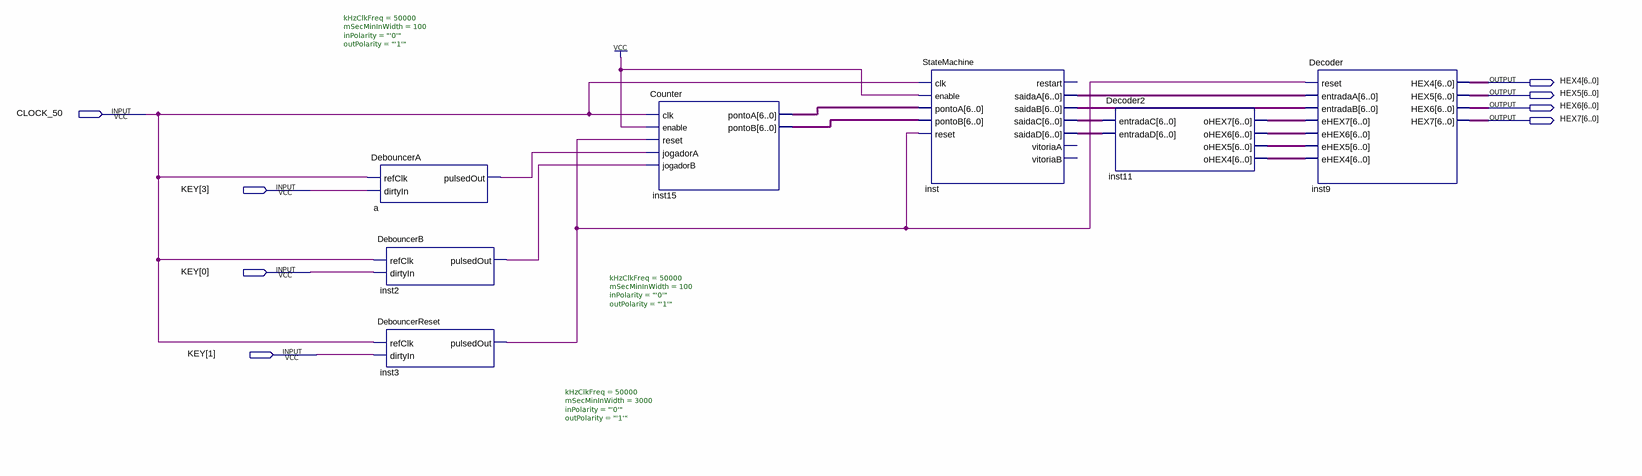
[diagram p0: schematic sheet]
// Quartus schematic bdfteste.bdf as structural Verilog: 7 symbols, 8 pins
module bdfteste (
  input  CLOCK_50,
  input  [3:0] KEY,
  output [6:0] HEX4,
  output [6:0] HEX5,
  output [6:0] HEX6,
  output [6:0] HEX7
);

  wire a_pulsedout, inst2_pulsedout, inst3_pulsedout;
  wire [6:0] inst11_ohex4, inst11_ohex5, inst11_ohex6, inst11_ohex7, inst15_pontoa, inst15_pontob,
       inst_saidaa, inst_saidab, inst_saidac, inst_saidad;

  DebouncerA #(.kHzClkFreq(50000), .mSecMinInWidth(100), .inPolarity("'0'"), .outPolarity("'1'")) a (
    .refClk(CLOCK_50), .dirtyIn(KEY[3]), .pulsedOut(a_pulsedout));
  DebouncerB #(.kHzClkFreq(50000), .mSecMinInWidth(100), .inPolarity("'0'"), .outPolarity("'1'")) inst2 (
    .refClk(CLOCK_50), .dirtyIn(KEY[0]), .pulsedOut(inst2_pulsedout));
  DebouncerReset #(.kHzClkFreq(50000), .mSecMinInWidth(3000), .inPolarity("'0'"), .outPolarity("'1'")) inst3 (
    .refClk(CLOCK_50), .dirtyIn(KEY[1]), .pulsedOut(inst3_pulsedout));
  Counter inst15 (
    .clk(CLOCK_50), .enable(1'b1), .reset(inst3_pulsedout), .jogadorA(a_pulsedout),
    .jogadorB(inst2_pulsedout), .pontoA(inst15_pontoa), .pontoB(inst15_pontob));
  StateMachine inst (
    .clk(CLOCK_50), .enable(1'b1), .pontoA(inst15_pontoa), .pontoB(inst15_pontob), .reset(inst3_pulsedout),
    .saidaA(inst_saidaa), .saidaB(inst_saidab), .saidaC(inst_saidac), .saidaD(inst_saidad));  // open: restart, vitoriaA, vitoriaB
  Decoder2 inst11 (
    .entradaC(inst_saidac), .entradaD(inst_saidad), .oHEX7(inst11_ohex7), .oHEX6(inst11_ohex6),
    .oHEX5(inst11_ohex5), .oHEX4(inst11_ohex4));
  Decoder inst9 (
    .reset(inst3_pulsedout), .entradaA(inst_saidaa), .entradaB(inst_saidab), .eHEX7(inst11_ohex7),
    .eHEX6(inst11_ohex6), .eHEX5(inst11_ohex5), .eHEX4(inst11_ohex4), .HEX4(HEX4), .HEX5(HEX5), .HEX6(HEX6),
    .HEX7(HEX7));
endmodule
